# Altium schematic sheet Mechanical.SchDoc: Dahlia Carrier Board
size A3; Organization: Toradex AG; Address1: Ebenaustrasse 10; Address2: Horw; Address3: 6048; Address4: Switzerland; DocumentNumber: 20; Revision: V1.1; SheetNumber: 20; SheetTotal: 21; PageSetup: Record=PageOptions|CenterHorizontal=True|CenterVertical=True|PrintScale=0.71|XCorrection=1.00|YCorrection=1.00|PrintKind=1|BorderSize=5000000|LeftOffset=0|BottomOffset=0|Orientation=2|PaperLength=1000|PaperWidth=1000|Scale=100|PaperSource=15|PrintQuality=600|MediaType=1|DitherType=10|PaperKind=A4|PrintScaleMode=1
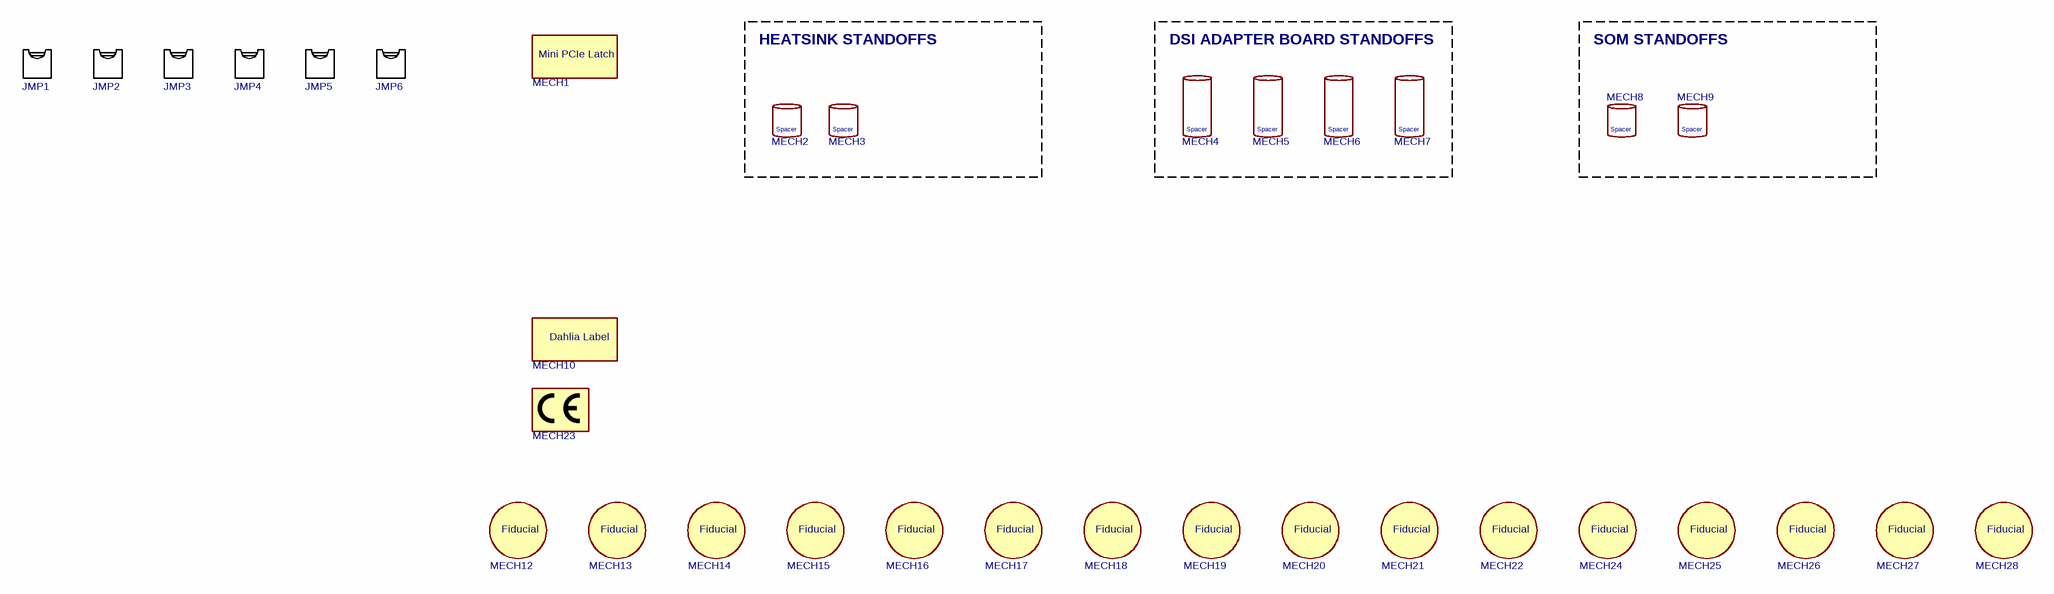
[diagram p0: Mechanical.SchDoc]

## Parts
JMP1  Shunt Jumper  (value not drawn)  (mechanical)
JMP2  Shunt Jumper  (value not drawn)  (mechanical)
JMP3  Shunt Jumper  (value not drawn)  (mechanical)
JMP4  Shunt Jumper  (value not drawn)  (mechanical)
JMP5  Shunt Jumper  (value not drawn)  (mechanical)
JMP6  Shunt Jumper  (value not drawn)  (mechanical)
MECH1  MECH-Mini-PCIe Latch  [MECH-Molex-48099-5701]  (value not drawn)
MECH2  Wurth-9774070243R  [MECH-Wurth-9774070243R]  (value not drawn)
MECH3  Wurth-9774070243R  [MECH-Wurth-9774070243R]  (value not drawn)
MECH4  Wurth-9774080360R  [MECH-Wurth-9774080360R]  (value not drawn)
MECH5  Wurth-9774080360R  [MECH-Wurth-9774080360R]  (value not drawn)
MECH6  Wurth-9774080360R  [MECH-Wurth-9774080360R]  (value not drawn)
MECH7  Wurth-9774080360R  [MECH-Wurth-9774080360R]  (value not drawn)
MECH8  Wurth-9774025243R  [MECH-Wurth-9774025243R]  (value not drawn)
MECH9  Wurth-9774025243R  [MECH-Wurth-9774025243R]  (value not drawn)
MECH10  Label-DahliaV1.1A  (value not drawn)  (mechanical)
MECH12  MECH-Fiducial  [T_Fiducial]  (value not drawn)  (no BOM)
MECH13  MECH-Fiducial  [T_Fiducial]  (value not drawn)  (no BOM)
MECH14  MECH-Fiducial  [T_Fiducial]  (value not drawn)  (no BOM)
MECH15  MECH-Fiducial  [T_Fiducial]  (value not drawn)  (no BOM)
MECH16  MECH-Fiducial  [T_Fiducial]  (value not drawn)  (no BOM)
MECH17  MECH-Fiducial  [T_Fiducial]  (value not drawn)  (no BOM)
MECH18  MECH-Fiducial  [T_Fiducial]  (value not drawn)  (no BOM)
MECH19  MECH-Fiducial  [T_Fiducial]  (value not drawn)  (no BOM)
MECH20  MECH-Fiducial  [T_Fiducial]  (value not drawn)  (no BOM)
MECH21  MECH-Fiducial  [T_Fiducial]  (value not drawn)  (no BOM)
MECH22  MECH-Fiducial  [T_Fiducial]  (value not drawn)  (no BOM)
MECH23  MECH-CE-Marking  [T_CE_Marking]  (value not drawn)  (no BOM)
MECH24  MECH-Fiducial  [T_Fiducial]  (value not drawn)  (no BOM)
MECH25  MECH-Fiducial  [T_Fiducial]  (value not drawn)  (no BOM)
MECH26  MECH-Fiducial  [T_Fiducial]  (value not drawn)  (no BOM)
MECH27  MECH-Fiducial  [T_Fiducial]  (value not drawn)  (no BOM)
MECH28  MECH-Fiducial  [T_Fiducial]  (value not drawn)  (no BOM)

## Blocks framed on the sheet
HEATSINK STANDOFFS: MECH2 MECH3
DSI ADAPTER BOARD STANDOFFS: MECH4-MECH7
SOM STANDOFFS: MECH8 MECH9

## Notes on the sheet
- Title
- Size:
- Date:
- A3
- Number:
- Time:
- Revision:
- Sheet
- of
- File:
- (in symbol MECH-Label-DahliaV1.1A) Dahlia Label
- (in symbol MECH-Molex-48099-5701) Mini PCIe Latch
- (in symbol MECH-Wurth-9774025243R) Spacer
- (in symbol MECH-Wurth-9774070243R) Spacer
- (in symbol MECH-Wurth-9774080360R) Spacer

## Library data of the parts
JMP1-JMP6 = MECH-Shunt-Jumper-Black-2.54mm: Manufacturer Name: JVE; Manufacturer Part No.: S1002-OPS60-01G
MECH1 = MECH-Molex-48099-5701: Mini-PCIe Latch; Manufacturer Name: Molex; Manufacturer Part No.: 48099-5701
MECH2 MECH3 = MECH-Wurth-9774070243R: Round Standoff M2x0.4 (7.00mm); Manufacturer Name: Wurth; Manufacturer Part No.: 9774070243R
MECH4-MECH7 = MECH-Wurth-9774080360R: Round Standoff M3x0.5 (8.00mm); Manufacturer Name: Wurth; Manufacturer Part No.: 9774080360R
MECH8 MECH9 = MECH-Wurth-9774025243R: Round Standoff M2x0.4 (2.50mm); Manufacturer Name: Wurth; Manufacturer Part No.: 9774025243R
MECH10 = MECH-Label-DahliaV1.1A: Label Sticker Dahlia V1.1A
MECH12-MECH22 MECH24-MECH28 = MECH-Fiducial: Fiducial
MECH23 = MECH-CE-Marking: CE Marking